# EAGLE schematic R3-URC18-V1 (EAGLE 8.6.0)
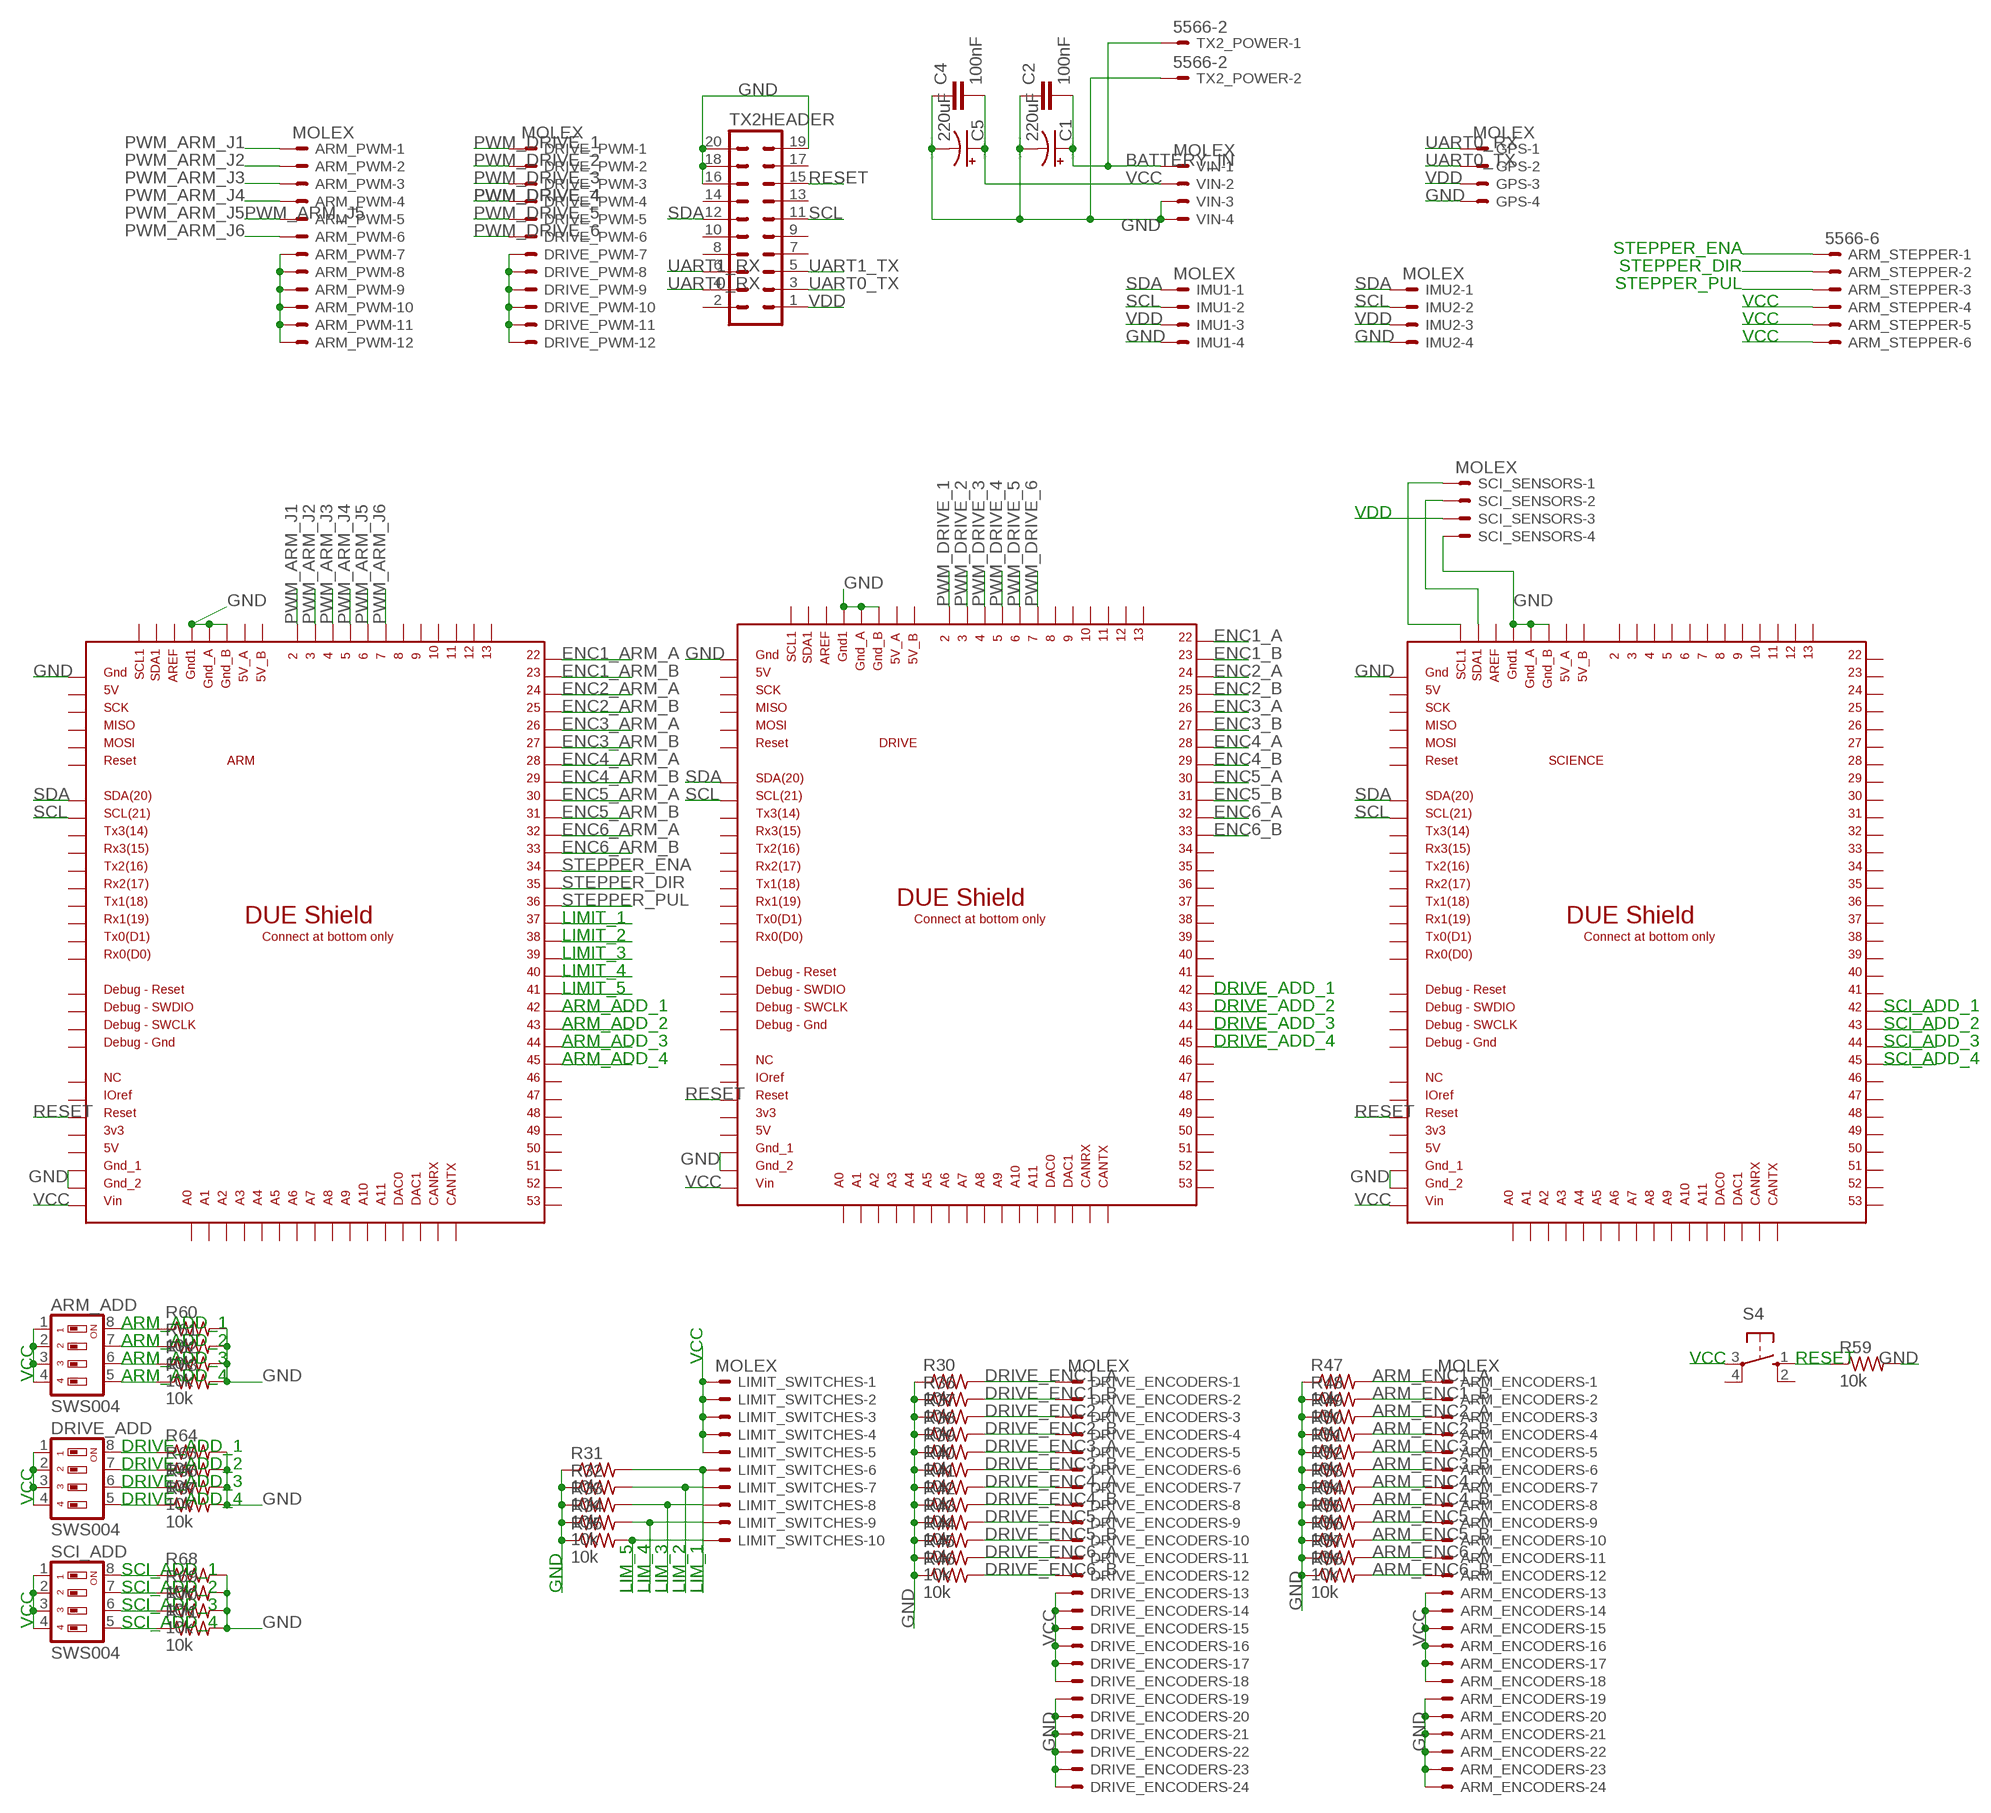
[diagram p0: schematic, sheet 1, part 1 of 2]
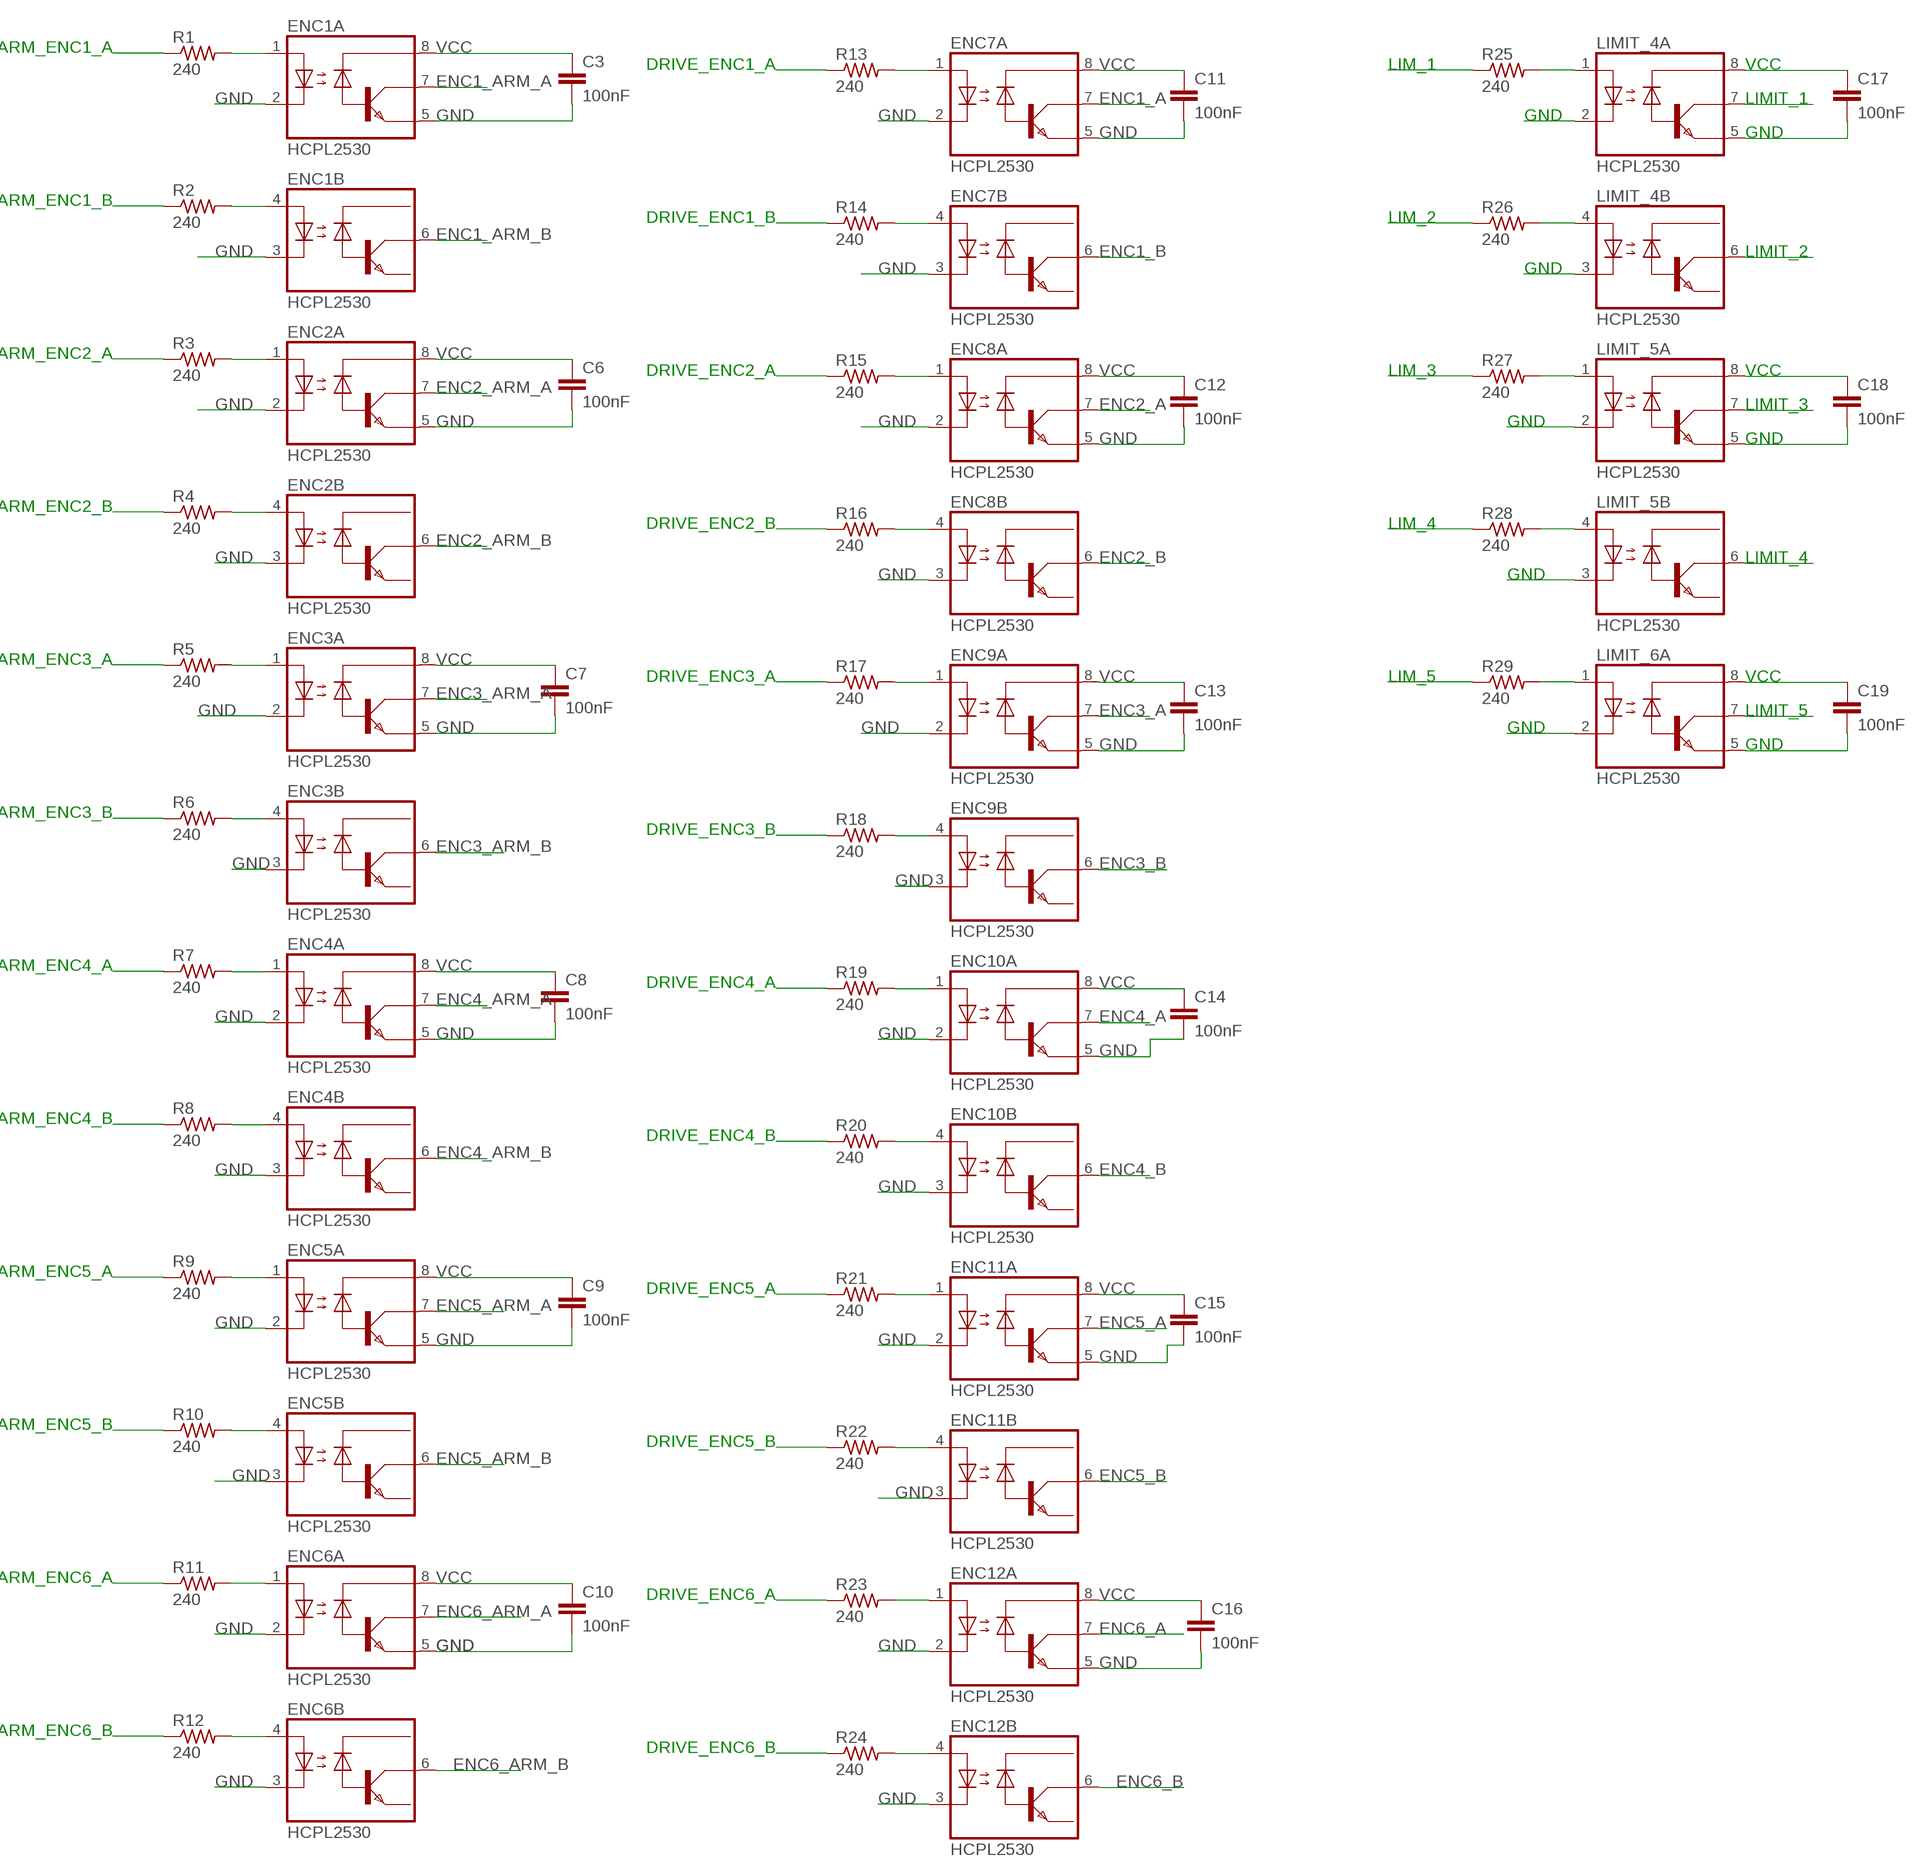
[diagram p1: schematic, sheet 1, part 2 of 2]

## Parts
ARM  DUE(BOTTOMONLY)  [DUE(BOTTOMONLY)]
ARM_ADD  SWS004  [SMS-004]
ARM_ENCODERS  MOLEX  5566-24  [5566-24]
ARM_PWM  MOLEX  5566-12  [5566-12]
ARM_STEPPER  5566-6  [5566-6]
C1  220uF  CPOL-USE7.5-18  [E7,5-18]
C2  100nF  C2.5/5  [C2.5-5]
C3  100nF  C2.5/5  [C2.5-5]
C4  100nF  C2.5/5  [C2.5-5]
C5  220uF  CPOL-USE7.5-18  [E7,5-18]
C6  100nF  C2.5/5  [C2.5-5]
C7  100nF  C2.5/5  [C2.5-5]
C8  100nF  C2.5/5  [C2.5-5]
C9  100nF  C2.5/5  [C2.5-5]
C10  100nF  C2.5/5  [C2.5-5]
C11  100nF  C2.5/5  [C2.5-5]
C12  100nF  C2.5/5  [C2.5-5]
C13  100nF  C2.5/5  [C2.5-5]
C14  100nF  C2.5/5  [C2.5-5]
C15  100nF  C2.5/5  [C2.5-5]
C16  100nF  C2.5/5  [C2.5-5]
C17  100nF  C2.5/5  [C2.5-5]
C18  100nF  C2.5/5  [C2.5-5]
C19  100nF  C2.5/5  [C2.5-5]
DRIVE  DUE(BOTTOMONLY)  [DUE(BOTTOMONLY)]
DRIVE_ADD  SWS004  [SMS-004]
DRIVE_ENCODERS  MOLEX  5566-24  [5566-24]
DRIVE_PWM  MOLEX  5566-12  [5566-12]
ENC1  HCPL2530  [DIL08]
ENC2  HCPL2530  [DIL08]
ENC3  HCPL2530  [DIL08]
ENC4  HCPL2530  [DIL08]
ENC5  HCPL2530  [DIL08]
ENC6  HCPL2530  [DIL08]
ENC7  HCPL2530  [DIL08]
ENC8  HCPL2530  [DIL08]
ENC9  HCPL2530  [DIL08]
ENC10  HCPL2530  [DIL08]
ENC11  HCPL2530  [DIL08]
ENC12  HCPL2530  [DIL08]
GPS  MOLEX  5566-4  [5566-4]
IMU1  MOLEX  5566-4  [5566-4]
IMU2  MOLEX  5566-4  [5566-4]
LIMIT_4  HCPL2530  [DIL08]
LIMIT_5  HCPL2530  [DIL08]
LIMIT_6  HCPL2530  [DIL08]
LIMIT_SWITCHES  MOLEX  5566-10  [5566-10]
R1  240  R-US_0207/10  [0207/10]
R2  240  R-US_0207/10  [0207/10]
R3  240  R-US_0207/10  [0207/10]
R4  240  R-US_0207/10  [0207/10]
R5  240  R-US_0207/10  [0207/10]
R6  240  R-US_0207/10  [0207/10]
R7  240  R-US_0207/10  [0207/10]
R8  240  R-US_0207/10  [0207/10]
R9  240  R-US_0207/10  [0207/10]
R10  240  R-US_0207/10  [0207/10]
R11  240  R-US_0207/10  [0207/10]
R12  240  R-US_0207/10  [0207/10]
R13  240  R-US_0207/10  [0207/10]
R14  240  R-US_0207/10  [0207/10]
R15  240  R-US_0207/10  [0207/10]
R16  240  R-US_0207/10  [0207/10]
R17  240  R-US_0207/10  [0207/10]
R18  240  R-US_0207/10  [0207/10]
R19  240  R-US_0207/10  [0207/10]
R20  240  R-US_0207/10  [0207/10]
R21  240  R-US_0207/10  [0207/10]
R22  240  R-US_0207/10  [0207/10]
R23  240  R-US_0207/10  [0207/10]
R24  240  R-US_0207/10  [0207/10]
R25  240  R-US_0207/10  [0207/10]
R26  240  R-US_0207/10  [0207/10]
R27  240  R-US_0207/10  [0207/10]
R28  240  R-US_0207/10  [0207/10]
R29  240  R-US_0207/10  [0207/10]
R30  10k  R-US_0207/10  [0207/10]
R31  10k  R-US_0207/10  [0207/10]
R32  10k  R-US_0207/10  [0207/10]
R33  10k  R-US_0207/10  [0207/10]
R34  10k  R-US_0207/10  [0207/10]
R35  10k  R-US_0207/10  [0207/10]
R36  10k  R-US_0207/10  [0207/10]
R37  10k  R-US_0207/10  [0207/10]
R38  10k  R-US_0207/10  [0207/10]
R39  10k  R-US_0207/10  [0207/10]
R40  10k  R-US_0207/10  [0207/10]
R41  10k  R-US_0207/10  [0207/10]
R42  10k  R-US_0207/10  [0207/10]
R43  10k  R-US_0207/10  [0207/10]
R44  10k  R-US_0207/10  [0207/10]
R45  10k  R-US_0207/10  [0207/10]
R46  10k  R-US_0207/10  [0207/10]
R47  10k  R-US_0207/10  [0207/10]
R48  10k  R-US_0207/10  [0207/10]
R49  10k  R-US_0207/10  [0207/10]
R50  10k  R-US_0207/10  [0207/10]
R51  10k  R-US_0207/10  [0207/10]
R52  10k  R-US_0207/10  [0207/10]
R53  10k  R-US_0207/10  [0207/10]
R54  10k  R-US_0207/10  [0207/10]
R55  10k  R-US_0207/10  [0207/10]
R56  10k  R-US_0207/10  [0207/10]
R57  10k  R-US_0207/10  [0207/10]
R58  10k  R-US_0207/10  [0207/10]
R59  10k  R-US_0207/10  [0207/10]
R60  10k  R-US_0207/10  [0207/10]
R61  10k  R-US_0207/10  [0207/10]
R62  10k  R-US_0207/10  [0207/10]
R63  10k  R-US_0207/10  [0207/10]
R64  10k  R-US_0207/10  [0207/10]
R65  10k  R-US_0207/10  [0207/10]
R66  10k  R-US_0207/10  [0207/10]
R67  10k  R-US_0207/10  [0207/10]
R68  10k  R-US_0207/10  [0207/10]
R69  10k  R-US_0207/10  [0207/10]
R70  10k  R-US_0207/10  [0207/10]
R71  10k  R-US_0207/10  [0207/10]
S4  10-XX  [B3F-10XX]
SCI_ADD  SWS004  [SMS-004]
SCI_SENSORS  MOLEX  5566-4  [5566-4]
SCIENCE  DUE(BOTTOMONLY)  [DUE(BOTTOMONLY)]
TX2_POWER  5566-2  [5566-2]
TX2HEADER  MA10-2  [MA10-2]
VIN  MOLEX  5566-4  [5566-4]

## Nets
ARM_ADD_1: ARM.42 ARM_ADD.8 R60.1
ARM_ADD_2: ARM.43 ARM_ADD.7 R61.1
ARM_ADD_3: ARM.44 ARM_ADD.6 R62.1
ARM_ADD_4: ARM.45 ARM_ADD.5 R63.1
ARM_ENC1_A: ARM_ENCODERS.1 R1.1 R47.2
ARM_ENC1_B: ARM_ENCODERS.2 R2.1 R48.2
ARM_ENC2_A: ARM_ENCODERS.3 R3.1 R49.2
ARM_ENC2_B: ARM_ENCODERS.4 R4.1 R50.2
ARM_ENC3_A: ARM_ENCODERS.5 R5.1 R51.2
ARM_ENC3_B: ARM_ENCODERS.6 R6.1 R52.2
ARM_ENC4_A: ARM_ENCODERS.7 R7.1 R53.2
ARM_ENC4_B: ARM_ENCODERS.8 R8.1 R54.2
ARM_ENC5_A: ARM_ENCODERS.9 R9.1 R55.2
ARM_ENC5_B: ARM_ENCODERS.10 R10.1 R56.2
ARM_ENC6_A: ARM_ENCODERS.11 R11.1 R57.2
ARM_ENC6_B: ARM_ENCODERS.12 R12.1 R58.2
BATTERY_IN: C1.+ C2.2 TX2_POWER.1 VIN.1
DRIVE_ADD_1: DRIVE.42 DRIVE_ADD.8 R64.1
DRIVE_ADD_2: DRIVE.43 DRIVE_ADD.7 R65.1
DRIVE_ADD_3: DRIVE.44 DRIVE_ADD.6 R66.1
DRIVE_ADD_4: DRIVE.45 DRIVE_ADD.5 R67.1
DRIVE_ENC1_A: DRIVE_ENCODERS.1 R13.1 R30.2
DRIVE_ENC1_B: DRIVE_ENCODERS.2 R14.1 R36.2
DRIVE_ENC2_A: DRIVE_ENCODERS.3 R15.1 R37.2
DRIVE_ENC2_B: DRIVE_ENCODERS.4 R16.1 R38.2
DRIVE_ENC3_A: DRIVE_ENCODERS.5 R17.1 R39.2
DRIVE_ENC3_B: DRIVE_ENCODERS.6 R18.1 R40.2
DRIVE_ENC4_A: DRIVE_ENCODERS.7 R19.1 R41.2
DRIVE_ENC4_B: DRIVE_ENCODERS.8 R20.1 R42.2
DRIVE_ENC5_A: DRIVE_ENCODERS.9 R21.1 R43.2
DRIVE_ENC5_B: DRIVE_ENCODERS.10 R22.1 R44.2
DRIVE_ENC6_A: DRIVE_ENCODERS.11 R23.1 R45.2
DRIVE_ENC6_B: DRIVE_ENCODERS.12 R24.1 R46.2
ENC1_A: DRIVE.22 ENC7.7(A:VO1)
ENC1_ARM_A: ARM.22 ENC1.7(A:VO1)
ENC1_ARM_B: ARM.23 ENC1.6(B:VO2)
ENC1_B: DRIVE.23 ENC7.6(B:VO2)
ENC2_A: DRIVE.24 ENC8.7(A:VO1)
ENC2_ARM_A: ARM.24 ENC2.7(A:VO1)
ENC2_ARM_B: ARM.25 ENC2.6(B:VO2)
ENC2_B: DRIVE.25 ENC8.6(B:VO2)
ENC3_A: DRIVE.26 ENC9.7(A:VO1)
ENC3_ARM_A: ARM.26 ENC3.7(A:VO1)
ENC3_ARM_B: ARM.27 ENC3.6(B:VO2)
ENC3_B: DRIVE.27 ENC9.6(B:VO2)
ENC4_A: DRIVE.28 ENC10.7(A:VO1)
ENC4_ARM_A: ARM.28 ENC4.7(A:VO1)
ENC4_ARM_B: ARM.29 ENC4.6(B:VO2)
ENC4_B: DRIVE.29 ENC10.6(B:VO2)
ENC5_A: DRIVE.30 ENC11.7(A:VO1)
ENC5_ARM_A: ARM.30 ENC5.7(A:VO1)
ENC5_ARM_B: ARM.31 ENC5.6(B:VO2)
ENC5_B: DRIVE.31 ENC11.6(B:VO2)
ENC6_A: DRIVE.32 ENC12.7(A:VO1)
ENC6_ARM_A: ARM.32 ENC6.7(A:VO1)
ENC6_ARM_B: ARM.33 ENC6.6(B:VO2)
ENC6_B: DRIVE.33 ENC12.6(B:VO2)
GND: ARM.5V_ICSP ARM.GND1 ARM.GND_1 ARM.GND_2 ARM.GND_A ARM.GND_B ARM_ENCODERS.19 ARM_ENCODERS.20 ARM_ENCODERS.21 ARM_ENCODERS.22 ARM_ENCODERS.23 ARM_ENCODERS.24 C1.- C2.1 C3.2 C4.1 C5.- C6.2 C7.2 C8.2 C9.2 C10.2 C11.2 C12.2 C13.2 C14.2 C15.2 C16.2 C17.2 C18.2 C19.2 DRIVE.5V_ICSP DRIVE.GND1 DRIVE.GND_1 DRIVE.GND_2 DRIVE.GND_A DRIVE.GND_B DRIVE_ENCODERS.19 DRIVE_ENCODERS.20 DRIVE_ENCODERS.21 DRIVE_ENCODERS.22 DRIVE_ENCODERS.23 DRIVE_ENCODERS.24 ENC1.2(A:C1) ENC1.3(B:C2) ENC1.5(A:GND) ENC2.2(A:C1) ENC2.3(B:C2) ENC2.5(A:GND) ENC3.2(A:C1) ENC3.3(B:C2) ENC3.5(A:GND) ENC4.2(A:C1) ENC4.3(B:C2) ENC4.5(A:GND) ENC5.2(A:C1) ENC5.3(B:C2) ENC5.5(A:GND) ENC6.2(A:C1) ENC6.3(B:C2) ENC6.5(A:GND) ENC7.2(A:C1) ENC7.3(B:C2) ENC7.5(A:GND) ENC8.2(A:C1) ENC8.3(B:C2) ENC8.5(A:GND) ENC9.2(A:C1) ENC9.3(B:C2) ENC9.5(A:GND) ENC10.2(A:C1) ENC10.3(B:C2) ENC10.5(A:GND) ENC11.2(A:C1) ENC11.3(B:C2) ENC11.5(A:GND) ENC12.2(A:C1) ENC12.3(B:C2) ENC12.5(A:GND) GPS.4 IMU1.4 IMU2.4 LIMIT_4.2(A:C1) LIMIT_4.3(B:C2) LIMIT_4.5(A:GND) LIMIT_5.2(A:C1) LIMIT_5.3(B:C2) LIMIT_5.5(A:GND) LIMIT_6.2(A:C1) LIMIT_6.5(A:GND) R30.1 R31.1 R32.1 R33.1 R34.1 R35.1 R36.1 R37.1 R38.1 R39.1 R40.1 R41.1 R42.1 R43.1 R44.1 R45.1 R46.1 R47.1 R48.1 R49.1 R50.1 R51.1 R52.1 R53.1 R54.1 R55.1 R56.1 R57.1 R58.1 R59.2 R60.2 R61.2 R62.2 R63.2 R64.2 R65.2 R66.2 R67.2 R68.2 R69.2 R70.2 R71.2 SCI_SENSORS.4 SCIENCE.5V_ICSP SCIENCE.GND1 SCIENCE.GND_1 SCIENCE.GND_2 SCIENCE.GND_A SCIENCE.GND_B TX2_POWER.2 TX2HEADER.16 TX2HEADER.18 TX2HEADER.19 TX2HEADER.20 VIN.3 VIN.4
LIM_1: LIMIT_SWITCHES.6 R25.1 R31.2
LIM_2: LIMIT_SWITCHES.7 R26.1 R32.2
LIM_3: LIMIT_SWITCHES.8 R27.1 R33.2
LIM_4: LIMIT_SWITCHES.9 R28.1 R34.2
LIM_5: LIMIT_SWITCHES.10 R29.1 R35.2
LIMIT_1: ARM.37 LIMIT_4.7(A:VO1)
LIMIT_2: ARM.38 LIMIT_4.6(B:VO2)
LIMIT_3: ARM.39 LIMIT_5.7(A:VO1)
LIMIT_4: ARM.40 LIMIT_5.6(B:VO2)
LIMIT_5: ARM.41 LIMIT_6.7(A:VO1)
N$1: ARM_PWM.7 ARM_PWM.8 ARM_PWM.9 ARM_PWM.10 ARM_PWM.11 ARM_PWM.12
N$2: ENC1.1(A:A1) R1.2
N$3: ENC1.4(B:A2) R2.2
N$4: ENC2.1(A:A1) R3.2
N$5: ENC2.4(B:A2) R4.2
N$6: ENC3.1(A:A1) R5.2
N$7: ENC3.4(B:A2) R6.2
N$8: DRIVE_PWM.7 DRIVE_PWM.8 DRIVE_PWM.9 DRIVE_PWM.10 DRIVE_PWM.11 DRIVE_PWM.12
N$9: ENC4.1(A:A1) R7.2
N$10: ENC4.4(B:A2) R8.2
N$11: ENC5.1(A:A1) R9.2
N$12: ENC5.4(B:A2) R10.2
N$13: ENC6.1(A:A1) R11.2
N$14: ENC6.4(B:A2) R12.2
N$15: LIMIT_4.1(A:A1) R25.2
N$16: SCI_SENSORS.2 SCIENCE.SDA1
N$17: LIMIT_4.4(B:A2) R26.2
N$18: SCI_SENSORS.1 SCIENCE.SCL1
N$19: LIMIT_5.1(A:A1) R27.2
N$21: LIMIT_5.4(B:A2) R28.2
N$23: LIMIT_6.1(A:A1) R29.2
N$27: ENC7.1(A:A1) R13.2
N$28: ENC7.4(B:A2) R14.2
N$29: ENC8.1(A:A1) R15.2
N$30: ENC8.4(B:A2) R16.2
N$31: ENC9.1(A:A1) R17.2
N$32: ENC9.4(B:A2) R18.2
N$33: ENC10.1(A:A1) R19.2
N$34: ENC10.4(B:A2) R20.2
N$35: ENC11.1(A:A1) R21.2
N$36: ENC11.4(B:A2) R22.2
N$37: ENC12.1(A:A1) R23.2
N$38: ENC12.4(B:A2) R24.2
PWM_ARM_J1: ARM.2 ARM_PWM.1
PWM_ARM_J2: ARM.3 ARM_PWM.2
PWM_ARM_J3: ARM.4 ARM_PWM.3
PWM_ARM_J4: ARM.5 ARM_PWM.4
PWM_ARM_J5: ARM.6 ARM_PWM.5
PWM_ARM_J6: ARM.7 ARM_PWM.6
PWM_DRIVE_1: DRIVE.2 DRIVE_PWM.1
PWM_DRIVE_2: DRIVE.3 DRIVE_PWM.2
PWM_DRIVE_3: DRIVE.4 DRIVE_PWM.3
PWM_DRIVE_4: DRIVE.5 DRIVE_PWM.4
PWM_DRIVE_5: DRIVE.6 DRIVE_PWM.5
PWM_DRIVE_6: DRIVE.7 DRIVE_PWM.6
RESET: ARM.RESET DRIVE.RESET R59.1 S4.1(S) SCIENCE.RESET TX2HEADER.15
SCI_ADD_1: R68.1 SCI_ADD.8 SCIENCE.42
SCI_ADD_2: R69.1 SCI_ADD.7 SCIENCE.43
SCI_ADD_3: R70.1 SCI_ADD.6 SCIENCE.44
SCI_ADD_4: R71.1 SCI_ADD.5 SCIENCE.45
SCL: ARM.SCL DRIVE.SCL IMU1.2 IMU2.2 SCIENCE.SCL TX2HEADER.11
SDA: ARM.SDA DRIVE.SDA IMU1.1 IMU2.1 SCIENCE.SDA TX2HEADER.12
STEPPER_DIR: ARM.35 ARM_STEPPER.2
STEPPER_ENA: ARM.34 ARM_STEPPER.1
STEPPER_PUL: ARM.36 ARM_STEPPER.3
UART0_RX: GPS.1 TX2HEADER.4
UART0_TX: GPS.2 TX2HEADER.3
UART1_RX: TX2HEADER.6
UART1_TX: TX2HEADER.5
VCC: ARM.VIN ARM_ADD.1 ARM_ADD.2 ARM_ADD.3 ARM_ADD.4 ARM_ENCODERS.13 ARM_ENCODERS.14 ARM_ENCODERS.15 ARM_ENCODERS.16 ARM_ENCODERS.17 ARM_ENCODERS.18 ARM_STEPPER.4 ARM_STEPPER.5 ARM_STEPPER.6 C3.1 C4.2 C5.+ C6.1 C7.1 C8.1 C9.1 C10.1 C11.1 C12.1 C13.1 C14.1 C15.1 C16.1 C17.1 C18.1 C19.1 DRIVE.VIN DRIVE_ADD.1 DRIVE_ADD.2 DRIVE_ADD.3 DRIVE_ADD.4 DRIVE_ENCODERS.13 DRIVE_ENCODERS.14 DRIVE_ENCODERS.15 DRIVE_ENCODERS.16 DRIVE_ENCODERS.17 DRIVE_ENCODERS.18 ENC1.8(A:VCC) ENC2.8(A:VCC) ENC3.8(A:VCC) ENC4.8(A:VCC) ENC5.8(A:VCC) ENC6.8(A:VCC) ENC7.8(A:VCC) ENC8.8(A:VCC) ENC9.8(A:VCC) ENC10.8(A:VCC) ENC11.8(A:VCC) ENC12.8(A:VCC) LIMIT_4.8(A:VCC) LIMIT_5.8(A:VCC) LIMIT_6.8(A:VCC) LIMIT_SWITCHES.1 LIMIT_SWITCHES.2 LIMIT_SWITCHES.3 LIMIT_SWITCHES.4 LIMIT_SWITCHES.5 S4.3(P) SCI_ADD.1 SCI_ADD.2 SCI_ADD.3 SCI_ADD.4 SCIENCE.VIN VIN.2
VDD: GPS.3 IMU1.3 IMU2.3 SCI_SENSORS.3 TX2HEADER.1
Unconnected: ARM.3V3 ARM.5V ARM.5V_A ARM.5V_B ARM.8 ARM.9 ARM.10 ARM.11 ARM.12 ARM.13 ARM.46 ARM.47 ARM.48 ARM.49 ARM.50 ARM.51 ARM.52 ARM.53 ARM.A0 ARM.A1 ARM.A2 ARM.A3 ARM.A4 ARM.A5 ARM.A6 ARM.A7 ARM.A8 ARM.A9 ARM.A10 ARM.A11 ARM.AREF ARM.CANRX ARM.CANTX ARM.DAC0 ARM.DAC1 ARM.GND_DEBUG ARM.GND_ICSP ARM.IOREF ARM.MISO_ICSP ARM.MOSI_ICSP ARM.NC ARM.RESET_DEBUG ARM.RESET_ICSP ARM.RX0 ARM.RX1 ARM.RX2 ARM.RX3 ARM.SCK_ICSP ARM.SCL1 ARM.SDA1 ARM.SWCLK_DEBUG ARM.SWDIO_DEBUG ARM.TX0 ARM.TX1 ARM.TX2 ARM.TX3 DRIVE.3V3 DRIVE.5V DRIVE.5V_A DRIVE.5V_B DRIVE.8 DRIVE.9 DRIVE.10 DRIVE.11 DRIVE.12 DRIVE.13 DRIVE.34 DRIVE.35 DRIVE.36 DRIVE.37 DRIVE.38 DRIVE.39 DRIVE.40 DRIVE.41 DRIVE.46 DRIVE.47 DRIVE.48 DRIVE.49 DRIVE.50 DRIVE.51 DRIVE.52 DRIVE.53 DRIVE.A0 DRIVE.A1 DRIVE.A2 DRIVE.A3 DRIVE.A4 DRIVE.A5 DRIVE.A6 DRIVE.A7 DRIVE.A8 DRIVE.A9 DRIVE.A10 DRIVE.A11 DRIVE.AREF DRIVE.CANRX DRIVE.CANTX DRIVE.DAC0 DRIVE.DAC1 DRIVE.GND_DEBUG DRIVE.GND_ICSP DRIVE.IOREF DRIVE.MISO_ICSP DRIVE.MOSI_ICSP DRIVE.NC DRIVE.RESET_DEBUG DRIVE.RESET_ICSP DRIVE.RX0 DRIVE.RX1 DRIVE.RX2 DRIVE.RX3 DRIVE.SCK_ICSP DRIVE.SCL1 DRIVE.SDA1 DRIVE.SWCLK_DEBUG DRIVE.SWDIO_DEBUG DRIVE.TX0 DRIVE.TX1 DRIVE.TX2 DRIVE.TX3 LIMIT_6.3(B:C2) LIMIT_6.4(B:A2) LIMIT_6.6(B:VO2) S4.2(S1) S4.4(P1) SCIENCE.2 SCIENCE.3 SCIENCE.3V3 SCIENCE.4 SCIENCE.5 SCIENCE.5V SCIENCE.5V_A SCIENCE.5V_B SCIENCE.6 SCIENCE.7 SCIENCE.8 SCIENCE.9 SCIENCE.10 SCIENCE.11 SCIENCE.12 SCIENCE.13 SCIENCE.22 SCIENCE.23 SCIENCE.24 SCIENCE.25 SCIENCE.26 SCIENCE.27 SCIENCE.28 SCIENCE.29 SCIENCE.30 SCIENCE.31 SCIENCE.32 SCIENCE.33 SCIENCE.34 SCIENCE.35 SCIENCE.36 SCIENCE.37 SCIENCE.38 SCIENCE.39 SCIENCE.40 SCIENCE.41 SCIENCE.46 SCIENCE.47 SCIENCE.48 SCIENCE.49 SCIENCE.50 SCIENCE.51 SCIENCE.52 SCIENCE.53 SCIENCE.A0 SCIENCE.A1 SCIENCE.A2 SCIENCE.A3 SCIENCE.A4 SCIENCE.A5 SCIENCE.A6 SCIENCE.A7 SCIENCE.A8 SCIENCE.A9 SCIENCE.A10 SCIENCE.A11 SCIENCE.AREF SCIENCE.CANRX SCIENCE.CANTX SCIENCE.DAC0 SCIENCE.DAC1 SCIENCE.GND_DEBUG SCIENCE.GND_ICSP SCIENCE.IOREF SCIENCE.MISO_ICSP SCIENCE.MOSI_ICSP SCIENCE.NC SCIENCE.RESET_DEBUG SCIENCE.RESET_ICSP SCIENCE.RX0 SCIENCE.RX1 SCIENCE.RX2 SCIENCE.RX3 SCIENCE.SCK_ICSP SCIENCE.SWCLK_DEBUG SCIENCE.SWDIO_DEBUG SCIENCE.TX0 SCIENCE.TX1 SCIENCE.TX2 SCIENCE.TX3 TX2HEADER.2 TX2HEADER.7 TX2HEADER.8 TX2HEADER.9 TX2HEADER.10 TX2HEADER.13 TX2HEADER.14 TX2HEADER.17

## Library data of the parts
ARM DRIVE SCIENCE = DUElib130425:DUE(BOTTOMONLY)
ARM_ADD DRIVE_ADD SCI_ADD = smd-special:SWS004: SMD Dip Switch 4 pol.
ARM_ENCODERS DRIVE_ENCODERS = con-molex:5566-24: Mini FIT connector 24 pol Source: http://www.molex.com; MF: MOLEX; OC_FARNELL: unknown; OC_NEWARK: unknown
ARM_PWM DRIVE_PWM = con-molex:5566-12: Mini FIT connector 12 pol Source: http://www.molex.com; MF: MOLEX; OC_FARNELL: unknown; OC_NEWARK: unknown
ARM_STEPPER = con-molex:5566-6: Mini FIT connector 6 pol Source: http://www.molex.com; MF: MOLEX; MPN: 95566-61002; OC_FARNELL: unknown; OC_NEWARK: 22K8620
C1 C5 = resistor:CPOL-US: POLARIZED CAPACITOR, American symbol
C2-C4 C6-C19 = capacitor-wima:C: CAPACITOR naming: grid - package width
ENC1-ENC12 LIMIT_4-LIMIT_6 = optocoupler:HCPL2530: HEWLETT PACKARD OPTO COUPLER; MF: AGILENT TECHNOLOGIES; MPN: HCPL-2530-000E; OC_FARNELL: 9994793; OC_NEWARK: 31K6974
GPS IMU1 IMU2 SCI_SENSORS VIN = con-molex:5566-4: Mini FIT connector 4 pol Source: http://www.molex.com; MF: MOLEX; OC_FARNELL: unknown; OC_NEWARK: unknown
LIMIT_SWITCHES = con-molex:5566-10: Mini FIT connector 10 pol Source: http://www.molex.com; MF: MOLEX; OC_FARNELL: unknown; OC_NEWARK: unknown
R1-R71 = rcl:R-US_: RESISTOR, American symbol; SPICEPREFIX: R
S4 = switch-omron:10-XX: OMRON SWITCH; MPN: B3F-1000; OC_FARNELL: 176432; OC_NEWARK: 36M3542
TX2_POWER = con-molex:5566-2: Mini FIT connector 2 pol Source: http://www.molex.com; MF: MOLEX; OC_FARNELL: 1822072; OC_NEWARK: unknown
TX2HEADER = con-lstb:MA10-2: PIN HEADER; OC_FARNELL: unknown; OC_NEWARK: unknown